# Altium schematic sheet Misc - Holes, Fiducials.SchDoc: [24] Misc - Holes, Fiducials
size A4; ApprovedBy: Nagy Richard; CheckedBy: Nagy Richard; Author: Nagy Richard; CompanyName: EmbedCore; DrawnBy: Nagy Richard; Engineer: Nagy Richard; Organization: EmbedCore; DocumentNumber: 24; Revision: 1.0; SheetNumber: 24; SheetTotal: 25
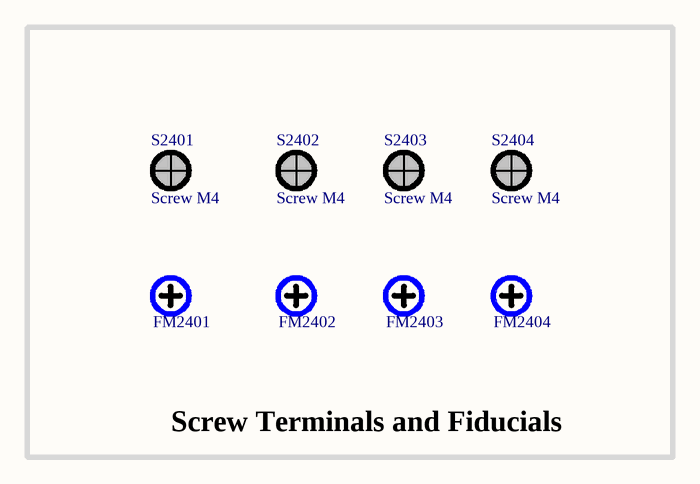
[diagram p0: Misc - Holes, Fiducials.SchDoc]

## Parts
FM2401  Fiducial Marker  [FIDUCIAL_CROSS_1MM5]  (value not drawn)  (no BOM)
FM2402  Fiducial Marker  [FIDUCIAL_CROSS_1MM5]  (value not drawn)  (no BOM)
FM2403  Fiducial Marker  [FIDUCIAL_CROSS_1MM5]  (value not drawn)  (no BOM)
FM2404  Fiducial Marker  [FIDUCIAL_CROSS_1MM5]  (value not drawn)  (no BOM)
S2401  Screw M4  [Screw M4]
S2402  Screw M4  [Screw M4]
S2403  Screw M4  [Screw M4]
S2404  Screw M4  [Screw M4]

## Blocks framed on the sheet
Screw Terminals and Fiducials: FM2401-FM2404 S2401-S2404

## Notes on the sheet
- Title:
- Drawn By:
- Page Contents:
- Checked By:
- Size:
- Date:
- File:
- License:
- Email:
- A4
- Number:
- Time:
- Revision:
- Sheet
- Website:
- of

## Library data of the parts
FM2401-FM2404 = FIDUCIAL_CROSS_1MM5: Fiducial Marker Cross 1.5mm NO BOM